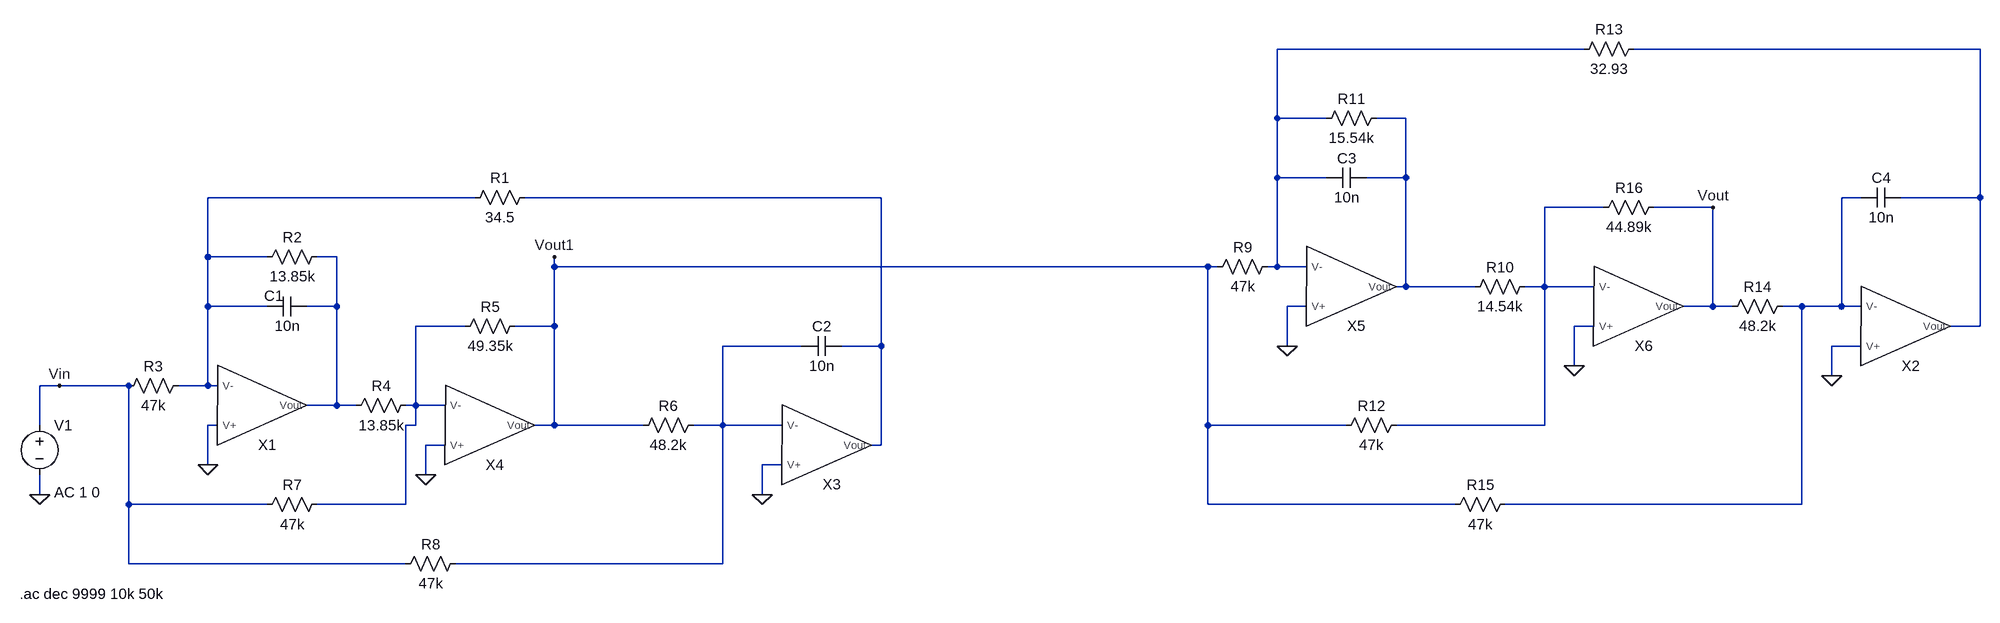
[diagram p0: schematic FleischerTowCascada.asc]
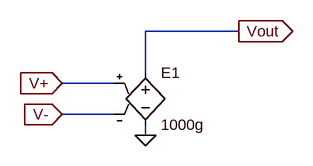
[diagram p1: sub-circuit nutriopamp.asc]
FleischerTowCascada.asc, the LTspice schematic file:
Version 4
SHEET 1 2856 680
WIRE 1744 -304 1248 -304
WIRE 2384 -304 1824 -304
WIRE 1248 -192 1248 -304
WIRE 1328 -192 1248 -192
WIRE 1456 -192 1408 -192
WIRE 1248 -96 1248 -192
WIRE 1328 -96 1248 -96
WIRE 1456 -96 1456 -192
WIRE 1456 -96 1392 -96
WIRE -48 -64 -480 -64
WIRE 608 -64 32 -64
WIRE 2192 -64 2160 -64
WIRE 2384 -64 2384 -304
WIRE 2384 -64 2256 -64
WIRE 1776 -48 1680 -48
WIRE 1952 -48 1856 -48
WIRE -480 32 -480 -64
WIRE -384 32 -480 32
WIRE -272 32 -304 32
WIRE 80 48 80 32
WIRE 1136 48 80 48
WIRE 1152 48 1136 48
WIRE 1248 48 1248 -96
WIRE 1248 48 1232 48
WIRE 1296 48 1248 48
WIRE 1456 80 1456 -96
WIRE 1456 80 1440 80
WIRE 1568 80 1456 80
WIRE 1680 80 1680 -48
WIRE 1680 80 1648 80
WIRE 1760 80 1680 80
WIRE -480 112 -480 32
WIRE -384 112 -480 112
WIRE -272 112 -272 32
WIRE -272 112 -320 112
WIRE 1296 112 1264 112
WIRE 1952 112 1952 -48
WIRE 1952 112 1904 112
WIRE 1984 112 1952 112
WIRE 2096 112 2064 112
WIRE 2160 112 2160 -64
WIRE 2160 112 2096 112
WIRE 2192 112 2160 112
WIRE -64 144 -144 144
WIRE 80 144 80 48
WIRE 80 144 16 144
WIRE 1760 144 1728 144
WIRE 2384 144 2384 -64
WIRE 2384 144 2336 144
WIRE 480 176 352 176
WIRE 608 176 608 -64
WIRE 608 176 544 176
WIRE 1264 176 1264 112
WIRE 2192 176 2144 176
WIRE 1728 208 1728 144
WIRE 2144 224 2144 176
WIRE -720 240 -752 240
WIRE -608 240 -720 240
WIRE -480 240 -480 112
WIRE -480 240 -528 240
WIRE -464 240 -480 240
WIRE -272 272 -272 112
WIRE -272 272 -320 272
WIRE -240 272 -272 272
WIRE -144 272 -144 144
WIRE -144 272 -160 272
WIRE -96 272 -144 272
WIRE -752 304 -752 240
WIRE -464 304 -480 304
WIRE -144 304 -144 272
WIRE -144 304 -160 304
WIRE 80 304 80 144
WIRE 80 304 48 304
WIRE 224 304 80 304
WIRE 352 304 352 176
WIRE 352 304 304 304
WIRE 448 304 352 304
WIRE 1136 304 1136 48
WIRE 1360 304 1136 304
WIRE 1680 304 1680 80
WIRE 1680 304 1440 304
WIRE -96 336 -128 336
WIRE 608 336 608 176
WIRE 608 336 592 336
WIRE -480 368 -480 304
WIRE 448 368 416 368
WIRE -128 384 -128 336
WIRE -752 416 -752 384
WIRE 416 416 416 368
WIRE -608 432 -608 240
WIRE -384 432 -608 432
WIRE -160 432 -160 304
WIRE -160 432 -304 432
WIRE 1136 432 1136 304
WIRE 1536 432 1136 432
WIRE 2096 432 2096 112
WIRE 2096 432 1616 432
WIRE -608 528 -608 432
WIRE -160 528 -608 528
WIRE 352 528 352 304
WIRE 352 528 -80 528
FLAG -720 240 Vin
FLAG -480 368 0
FLAG -128 384 0
FLAG 416 416 0
FLAG 1264 176 0
FLAG 1728 208 0
FLAG 2144 224 0
FLAG 1952 -48 Vout
FLAG -752 416 0
FLAG 80 32 Vout1
SYMBOL NutriOpAmp -384 288 M180
SYMATTR InstName X1
SYMBOL NutriOpAmp 2272 160 M180
SYMATTR InstName X2
SYMBOL NutriOpAmp 528 352 M180
SYMATTR InstName X3
SYMBOL NutriOpAmp -16 320 M180
SYMATTR InstName X4
SYMBOL NutriOpAmp 1376 96 M180
SYMATTR InstName X5
SYMBOL NutriOpAmp 1840 128 M180
SYMATTR InstName X6
SYMBOL res 48 -80 R90
WINDOW 0 0 56 VBottom 2
WINDOW 3 32 56 VTop 2
SYMATTR InstName R1
SYMATTR Value 34.5
SYMBOL res -288 16 R90
WINDOW 0 0 56 VBottom 2
WINDOW 3 32 56 VTop 2
SYMATTR InstName R2
SYMATTR Value 13.85k
SYMBOL res -512 224 R90
WINDOW 0 0 56 VBottom 2
WINDOW 3 32 56 VTop 2
SYMATTR InstName R3
SYMATTR Value 47k
SYMBOL res -144 256 R90
WINDOW 0 0 56 VBottom 2
WINDOW 3 32 56 VTop 2
SYMATTR InstName R4
SYMATTR Value 13.85k
SYMBOL res 32 128 R90
WINDOW 0 0 56 VBottom 2
WINDOW 3 32 56 VTop 2
SYMATTR InstName R5
SYMATTR Value 49.35k
SYMBOL res 320 288 R90
WINDOW 0 0 56 VBottom 2
WINDOW 3 32 56 VTop 2
SYMATTR InstName R6
SYMATTR Value 48.2k
SYMBOL res -288 416 R90
WINDOW 0 0 56 VBottom 2
WINDOW 3 32 56 VTop 2
SYMATTR InstName R7
SYMATTR Value 47k
SYMBOL res -64 512 R90
WINDOW 0 0 56 VBottom 2
WINDOW 3 32 56 VTop 2
SYMATTR InstName R8
SYMATTR Value 47k
SYMBOL cap -320 96 R90
WINDOW 0 14 54 VBottom 2
WINDOW 3 32 32 VTop 2
SYMATTR InstName C1
SYMATTR Value 10n
SYMBOL cap 544 160 R90
WINDOW 0 0 32 VBottom 2
WINDOW 3 32 32 VTop 2
SYMATTR InstName C2
SYMATTR Value 10n
SYMBOL res 1248 32 R90
WINDOW 0 0 56 VBottom 2
WINDOW 3 32 56 VTop 2
SYMATTR InstName R9
SYMATTR Value 47k
SYMBOL res 1664 64 R90
WINDOW 0 0 56 VBottom 2
WINDOW 3 32 56 VTop 2
SYMATTR InstName R10
SYMATTR Value 14.54k
SYMBOL res 1424 -208 R90
WINDOW 0 0 56 VBottom 2
WINDOW 3 32 56 VTop 2
SYMATTR InstName R11
SYMATTR Value 15.54k
SYMBOL res 1456 288 R90
WINDOW 0 0 56 VBottom 2
WINDOW 3 32 56 VTop 2
SYMATTR InstName R12
SYMATTR Value 47k
SYMBOL res 2080 96 R90
WINDOW 0 0 56 VBottom 2
WINDOW 3 32 56 VTop 2
SYMATTR InstName R14
SYMATTR Value 48.2k
SYMBOL res 1632 416 R90
WINDOW 0 0 56 VBottom 2
WINDOW 3 32 56 VTop 2
SYMATTR InstName R15
SYMATTR Value 47k
SYMBOL res 1872 -64 R90
WINDOW 0 0 56 VBottom 2
WINDOW 3 32 56 VTop 2
SYMATTR InstName R16
SYMATTR Value 44.89k
SYMBOL cap 1392 -112 R90
WINDOW 0 0 32 VBottom 2
WINDOW 3 32 32 VTop 2
SYMATTR InstName C3
SYMATTR Value 10n
SYMBOL cap 2256 -80 R90
WINDOW 0 0 32 VBottom 2
WINDOW 3 32 32 VTop 2
SYMATTR InstName C4
SYMATTR Value 10n
SYMBOL res 1840 -320 R90
WINDOW 0 0 56 VBottom 2
WINDOW 3 32 56 VTop 2
SYMATTR InstName R13
SYMATTR Value 32.93
SYMBOL voltage -752 288 R0
WINDOW 123 24 124 Left 2
WINDOW 39 0 0 Left 2
SYMATTR Value2 AC 1 0
SYMATTR InstName V1
SYMATTR Value ""
TEXT -784 576 Left 2 !.ac dec 9999 10k 50k

nutriopamp.asc, the sub-circuit schematic file:
Version 4
SHEET 1 880 680
WIRE 352 64 208 64
WIRE 208 128 208 64
WIRE 160 144 80 144
WIRE 160 192 80 192
WIRE 208 224 208 208
FLAG 208 224 0
FLAG 80 144 V+
IOPIN 80 144 In
FLAG 80 192 V-
IOPIN 80 192 In
FLAG 352 64 Vout
IOPIN 352 64 Out
SYMBOL e 208 112 R0
SYMATTR InstName E1
SYMATTR Value 1000g

The netlist it stands for:
* FleischerTowCascada.asc
XX1 0 N004 N008 nutriopamp
XX2 0 N006 N002 nutriopamp
XX3 0 N010 N005 nutriopamp
XX4 0 N009 Vout1 nutriopamp
XX5 0 N001 N003 nutriopamp
XX6 0 N007 Vout nutriopamp
R1 N005 N004 34.5
R2 N008 N004 13.85k
R3 N004 Vin 47k
R4 N009 N008 13.85k
R5 Vout1 N009 49.35k
R6 N010 Vout1 48.2k
R7 N009 Vin 47k
R8 N010 Vin 47k
C1 N008 N004 10n
C2 N005 N010 10n
R9 N001 Vout1 47k
R10 N007 N003 14.54k
R11 N003 N001 15.54k
R12 N007 Vout1 47k
R14 N006 Vout 48.2k
R15 N006 Vout1 47k
R16 Vout N007 44.89k
C3 N003 N001 10n
C4 N002 N006 10n
R13 N002 N001 32.93
V1 Vin 0 AC 1 0

* block symbol definitions
.subckt nutriopamp V+ V- Vout
E1 Vout 0 V+ V- 1000g
.ends nutriopamp

.ac dec 9999 10k 50k
.backanno
.end